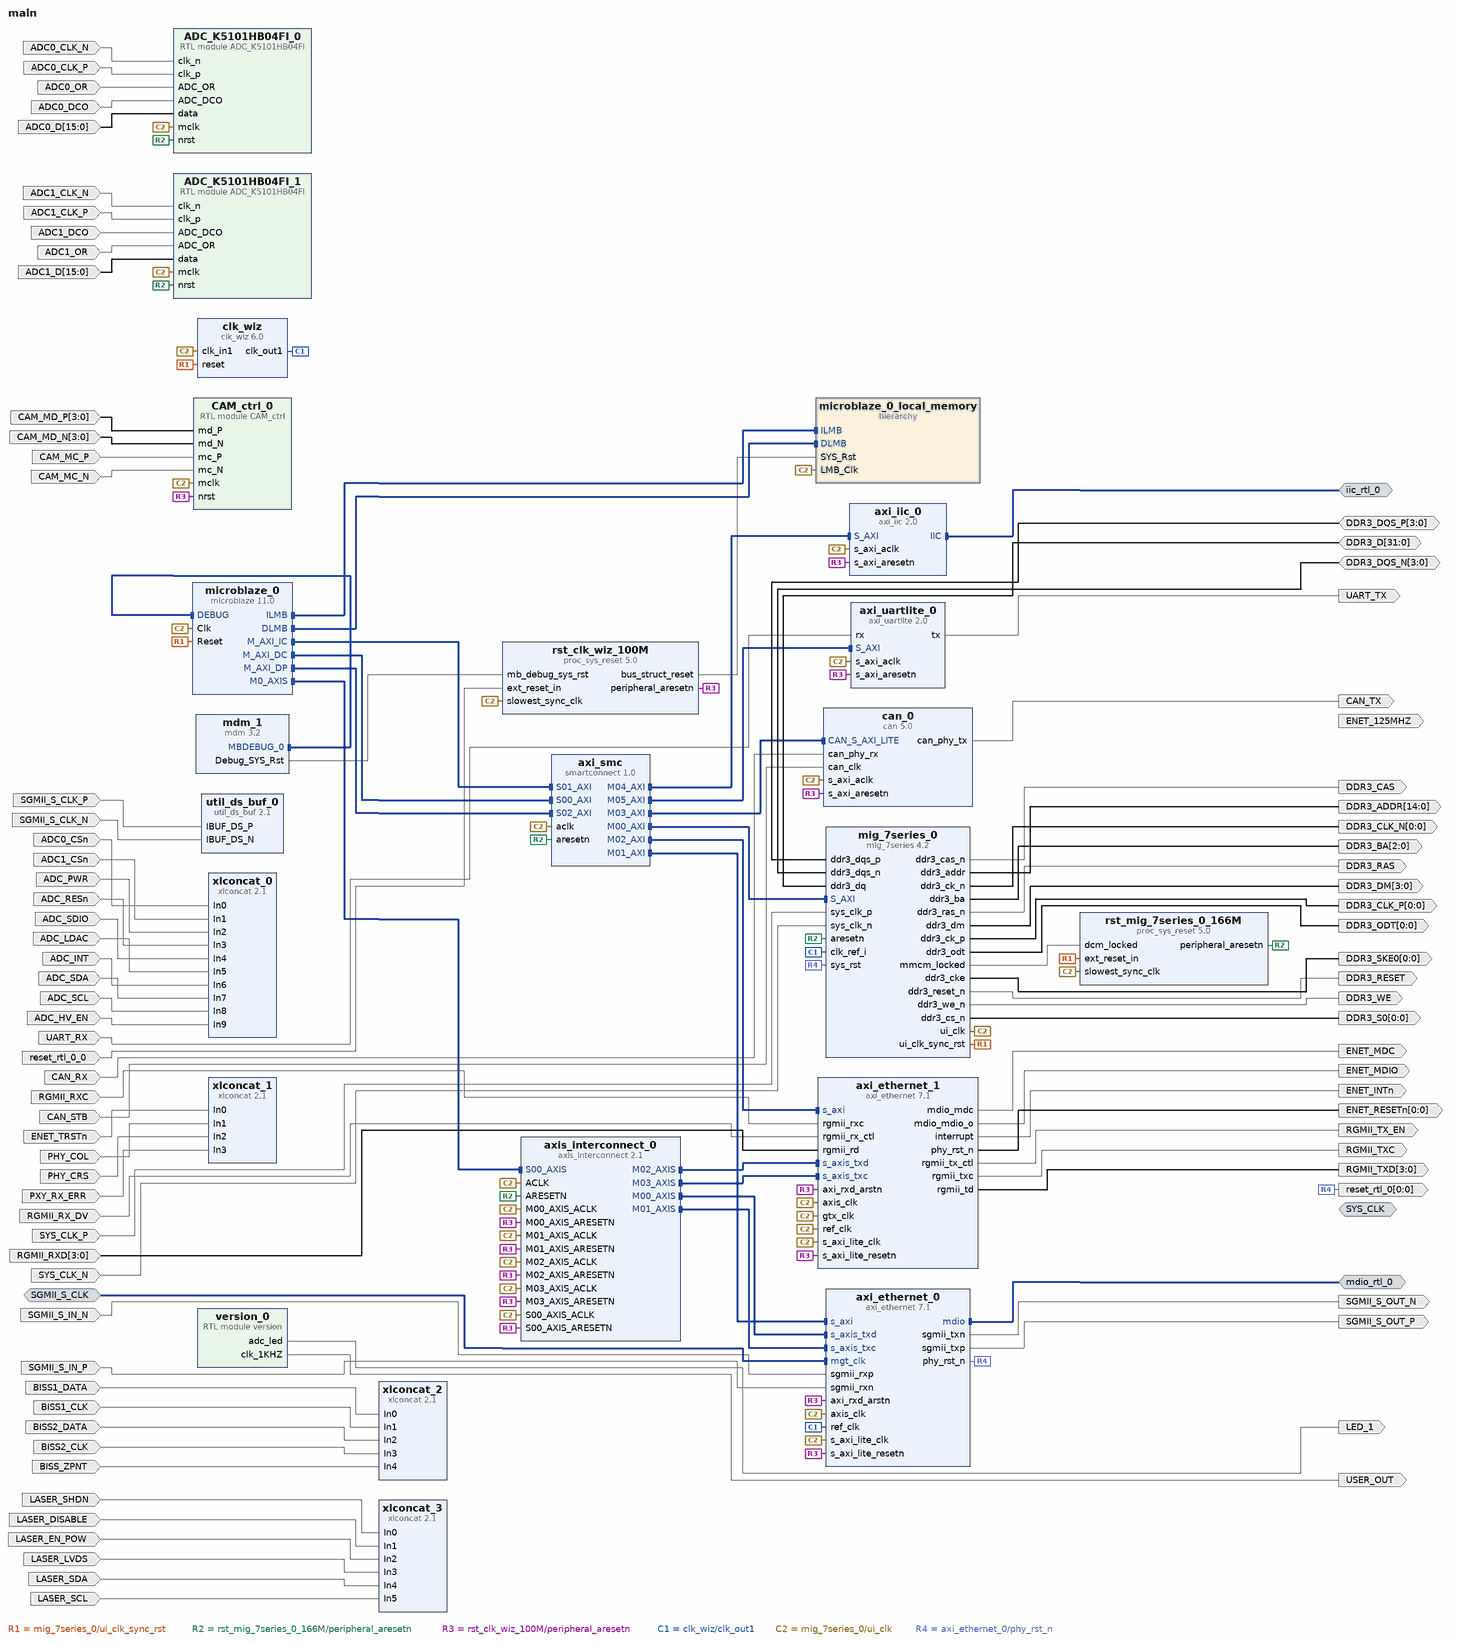
[diagram p0: block diagram of the top level]
# Vivado block design main, xc7a200tfbv484-2L, Vivado 2019.1
create_bd_design main

create_bd_intf_port -mode Master -vlnv xilinx.com:interface:mdio_rtl:1.0 mdio_rtl_0
create_bd_intf_port -mode Slave -vlnv xilinx.com:interface:diff_clock_rtl:1.0 SGMII_S_CLK
set_property -dict {CONFIG.FREQ_HZ 100000000} [get_bd_intf_ports SGMII_S_CLK]
create_bd_intf_port -mode Master -vlnv xilinx.com:interface:iic_rtl:1.0 iic_rtl_0
create_bd_intf_port -mode Master -vlnv xilinx.com:interface:diff_clock_rtl:1.0 SYS_CLK
create_bd_port -dir O -from 14 -to 0 DDR3_ADDR
create_bd_port -dir IO -from 31 -to 0 DDR3_D
create_bd_port -dir O DDR3_RAS
create_bd_port -dir O DDR3_CAS
create_bd_port -dir O DDR3_WE
create_bd_port -dir O -from 0 -to 0 DDR3_S0
create_bd_port -dir O -from 0 -to 0 DDR3_ODT
create_bd_port -dir O -from 0 -to 0 DDR3_SKE0
create_bd_port -dir O DDR3_RESET
create_bd_port -dir O -from 0 -to 0 DDR3_CLK_P
create_bd_port -dir O -from 0 -to 0 DDR3_CLK_N
create_bd_port -dir I SGMII_S_IN_P
create_bd_port -dir I SGMII_S_IN_N
create_bd_port -dir O SGMII_S_OUT_P
create_bd_port -dir O SGMII_S_OUT_N
create_bd_port -dir O ENET_MDC
create_bd_port -dir O -from 0 -to 0 ENET_RESETn
create_bd_port -dir O ENET_INTn
create_bd_port -dir O ENET_125MHZ
create_bd_port -dir O -from 3 -to 0 RGMII_TXD
create_bd_port -dir I -from 3 -to 0 RGMII_RXD
create_bd_port -dir O RGMII_TXC
create_bd_port -dir O RGMII_TX_EN
create_bd_port -dir I RGMII_RXC
create_bd_port -dir I RGMII_RX_DV
create_bd_port -dir O ENET_MDIO
create_bd_port -dir O -from 3 -to 0 DDR3_DM
create_bd_port -dir IO -from 3 -to 0 DDR3_DQS_N
create_bd_port -dir IO -from 3 -to 0 DDR3_DQS_P
create_bd_port -dir O -from 2 -to 0 DDR3_BA
create_bd_port -dir I -type rst reset_rtl_0_0
set_property -dict {CONFIG.POLARITY ACTIVE_LOW} [get_bd_ports reset_rtl_0_0]
create_bd_port -dir I -type rst CAN_RX
set_property -dict {CONFIG.POLARITY ACTIVE_LOW} [get_bd_ports CAN_RX]
create_bd_port -dir O CAN_TX
create_bd_port -dir I -type rst UART_RX
set_property -dict {CONFIG.POLARITY ACTIVE_LOW} [get_bd_ports UART_RX]
create_bd_port -dir O UART_TX
create_bd_port -dir O -from 0 -to 0 -type rst reset_rtl_0
set_property -dict {CONFIG.POLARITY ACTIVE_LOW} [get_bd_ports reset_rtl_0]
create_bd_port -dir I ADC0_CLK_P
create_bd_port -dir I ADC0_CLK_N
create_bd_port -dir I ADC0_DCO
create_bd_port -dir I ADC0_OR
create_bd_port -dir I -from 15 -to 0 ADC0_D
create_bd_port -dir I ADC1_CLK_N
create_bd_port -dir I ADC1_CLK_P
create_bd_port -dir I -from 15 -to 0 ADC1_D
create_bd_port -dir I ADC1_DCO
create_bd_port -dir I ADC1_OR
create_bd_port -dir I PHY_COL
create_bd_port -dir I PXY_RX_ERR
create_bd_port -dir I ENET_TRSTn
create_bd_port -dir I PHY_CRS
create_bd_port -dir I ADC0_CSn
create_bd_port -dir I ADC1_CSn
create_bd_port -dir I ADC_PWR
create_bd_port -dir I ADC_SDIO
create_bd_port -dir I ADC_RESn
create_bd_port -dir I ADC_SDA
create_bd_port -dir I ADC_LDAC
create_bd_port -dir I ADC_INT
create_bd_port -dir I ADC_SCL
create_bd_port -dir I ADC_HV_EN
create_bd_port -dir I BISS1_DATA
create_bd_port -dir I BISS1_CLK
create_bd_port -dir I BISS2_DATA
create_bd_port -dir I BISS2_CLK
create_bd_port -dir I BISS_ZPNT
create_bd_port -dir O LED_1
create_bd_port -dir O USER_OUT
create_bd_port -dir I LASER_SHDN
create_bd_port -dir I LASER_DISABLE
create_bd_port -dir I LASER_EN_POW
create_bd_port -dir I LASER_LVDS
create_bd_port -dir I LASER_SDA
create_bd_port -dir I LASER_SCL
create_bd_port -dir I -from 3 -to 0 CAM_MD_N
create_bd_port -dir I -from 3 -to 0 CAM_MD_P
create_bd_port -dir I CAM_MC_P
create_bd_port -dir I CAM_MC_N
create_bd_port -dir I -type clk CAN_STB
set_property -dict {CONFIG.FREQ_HZ 10000000} [get_bd_ports CAN_STB]
create_bd_port -dir I -type clk SYS_CLK_P
set_property -dict {CONFIG.FREQ_HZ 133000000} [get_bd_ports SYS_CLK_P]
create_bd_port -dir I -type clk SYS_CLK_N
set_property -dict {CONFIG.FREQ_HZ 133000000} [get_bd_ports SYS_CLK_N]
create_bd_port -dir I -type clk SGMII_S_CLK_P
set_property -dict {CONFIG.FREQ_HZ 200000000} [get_bd_ports SGMII_S_CLK_P]
create_bd_port -dir I -type clk SGMII_S_CLK_N
set_property -dict {CONFIG.FREQ_HZ 200000000} [get_bd_ports SGMII_S_CLK_N]

create_bd_cell -type ip -vlnv xilinx.com:ip:axi_ethernet:7.1 axi_ethernet_1
set_property -dict {CONFIG.PHY_TYPE RGMII} [get_bd_cells axi_ethernet_1]
create_bd_cell -type ip -vlnv xilinx.com:ip:util_ds_buf:2.1 util_ds_buf_0
set_property -dict {CONFIG.C_BUF_TYPE IBUFDS} [get_bd_cells util_ds_buf_0]
create_bd_cell -type ip -vlnv xilinx.com:ip:axi_ethernet:7.1 axi_ethernet_0
set_property -dict {CONFIG.PHY_TYPE SGMII} [get_bd_cells axi_ethernet_0]
create_bd_cell -type ip -vlnv xilinx.com:ip:mig_7series:4.2 mig_7series_0
set_property -dict [list \
  CONFIG.BOARD_MIG_PARAM Custom \
  CONFIG.MIG_DONT_TOUCH_PARAM Custom \
  CONFIG.RESET_BOARD_INTERFACE Custom \
  CONFIG.XML_INPUT_FILE mig_b.prj \
] [get_bd_cells mig_7series_0]
create_bd_cell -type ip -vlnv xilinx.com:ip:microblaze:11.0 microblaze_0
set_property -dict [list \
  CONFIG.C_CACHE_BYTE_SIZE 8192 \
  CONFIG.C_DCACHE_ADDR_TAG 17 \
  CONFIG.C_DCACHE_BYTE_SIZE 8192 \
  CONFIG.C_DEBUG_ENABLED 1 \
  CONFIG.C_D_AXI 1 \
  CONFIG.C_D_LMB 1 \
  CONFIG.C_FSL_LINKS 1 \
  CONFIG.C_I_AXI 0 \
  CONFIG.C_I_LMB 1 \
  CONFIG.C_USE_DCACHE 1 \
  CONFIG.C_USE_ICACHE 1 \
] [get_bd_cells microblaze_0]
create_bd_cell -type ip -vlnv xilinx.com:ip:smartconnect:1.0 axi_smc
set_property -dict {CONFIG.NUM_MI 6 CONFIG.NUM_SI 3} [get_bd_cells axi_smc]
create_bd_cell -type ip -vlnv xilinx.com:ip:proc_sys_reset:5.0 rst_mig_7series_0_166M
create_bd_cell -type ip -vlnv xilinx.com:ip:axis_interconnect:2.1 axis_interconnect_0
set_property -dict {CONFIG.NUM_MI 4} [get_bd_cells axis_interconnect_0]
create_bd_cell -type ip -vlnv xilinx.com:ip:proc_sys_reset:5.0 rst_clk_wiz_100M
create_bd_cell -type ip -vlnv xilinx.com:ip:clk_wiz:6.0 clk_wiz
set_property -dict [list \
  CONFIG.CLKOUT2_JITTER 792.544 \
  CONFIG.CLKOUT2_PHASE_ERROR 832.251 \
  CONFIG.CLKOUT2_REQUESTED_OUT_FREQ 10.000 \
  CONFIG.CLKOUT2_USED true \
  CONFIG.MMCM_CLKOUT1_DIVIDE 65 \
  CONFIG.NUM_OUT_CLKS 2 \
] [get_bd_cells clk_wiz]
create_bd_cell -type hier microblaze_0_local_memory
create_bd_cell -type ip -vlnv xilinx.com:ip:mdm:3.2 mdm_1
create_bd_cell -type ip -vlnv xilinx.com:ip:can:5.0 can_0
create_bd_cell -type ip -vlnv xilinx.com:ip:axi_iic:2.0 axi_iic_0
create_bd_cell -type ip -vlnv xilinx.com:ip:axi_uartlite:2.0 axi_uartlite_0
create_bd_cell -type ip -vlnv xilinx.com:ip:xlconcat:2.1 xlconcat_0
set_property -dict {CONFIG.NUM_PORTS 10} [get_bd_cells xlconcat_0]
create_bd_cell -type ip -vlnv xilinx.com:ip:xlconcat:2.1 xlconcat_1
set_property -dict {CONFIG.NUM_PORTS 4} [get_bd_cells xlconcat_1]
create_bd_cell -type ip -vlnv xilinx.com:ip:xlconcat:2.1 xlconcat_2
set_property -dict {CONFIG.NUM_PORTS 5} [get_bd_cells xlconcat_2]
create_bd_cell -type module -reference version version_0
create_bd_cell -type ip -vlnv xilinx.com:ip:xlconcat:2.1 xlconcat_3
set_property -dict {CONFIG.NUM_PORTS 6} [get_bd_cells xlconcat_3]
create_bd_cell -type module -reference ADC_K5101HB04FI ADC_K5101HB04FI_1
create_bd_cell -type module -reference ADC_K5101HB04FI ADC_K5101HB04FI_0
create_bd_cell -type module -reference CAM_ctrl CAM_ctrl_0

# ---- hierarchy /microblaze_0_local_memory ----
current_bd_instance /microblaze_0_local_memory
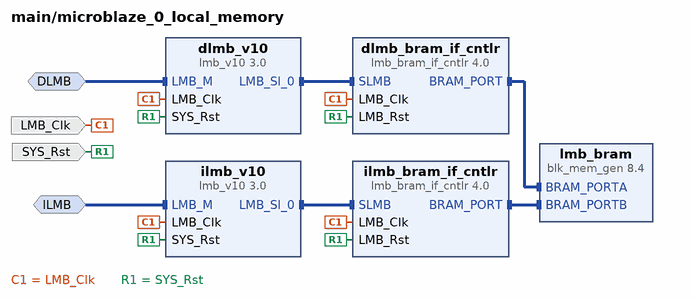
[diagram p1: block diagram inside /microblaze_0_local_memory]
create_bd_intf_pin -mode MirroredMaster -vlnv xilinx.com:interface:lmb_rtl:1.0 DLMB
create_bd_intf_pin -mode MirroredMaster -vlnv xilinx.com:interface:lmb_rtl:1.0 ILMB
create_bd_pin -dir I -type clk LMB_Clk
create_bd_pin -dir I -type rst SYS_Rst

create_bd_cell -type ip -vlnv xilinx.com:ip:lmb_v10:3.0 dlmb_v10
create_bd_cell -type ip -vlnv xilinx.com:ip:lmb_v10:3.0 ilmb_v10
create_bd_cell -type ip -vlnv xilinx.com:ip:lmb_bram_if_cntlr:4.0 dlmb_bram_if_cntlr
set_property -dict {CONFIG.C_ECC 0} [get_bd_cells dlmb_bram_if_cntlr]
create_bd_cell -type ip -vlnv xilinx.com:ip:lmb_bram_if_cntlr:4.0 ilmb_bram_if_cntlr
set_property -dict {CONFIG.C_ECC 0} [get_bd_cells ilmb_bram_if_cntlr]
create_bd_cell -type ip -vlnv xilinx.com:ip:blk_mem_gen:8.4 lmb_bram
set_property -dict {CONFIG.Memory_Type True_Dual_Port_RAM CONFIG.use_bram_block BRAM_Controller} [get_bd_cells lmb_bram]

# ---- connections ----

current_bd_instance /microblaze_0_local_memory
connect_bd_intf_net -intf_net microblaze_0_ilmb_cntlr [get_bd_intf_pins ilmb_bram_if_cntlr/BRAM_PORT] [get_bd_intf_pins lmb_bram/BRAM_PORTB]
connect_bd_intf_net -intf_net microblaze_0_dlmb_bus [get_bd_intf_pins dlmb_v10/LMB_Sl_0] [get_bd_intf_pins dlmb_bram_if_cntlr/SLMB]
connect_bd_intf_net -intf_net microblaze_0_ilmb_bus [get_bd_intf_pins ilmb_v10/LMB_Sl_0] [get_bd_intf_pins ilmb_bram_if_cntlr/SLMB]
connect_bd_intf_net -intf_net microblaze_0_ilmb [get_bd_intf_pins ILMB] [get_bd_intf_pins ilmb_v10/LMB_M]
connect_bd_intf_net -intf_net microblaze_0_dlmb [get_bd_intf_pins DLMB] [get_bd_intf_pins dlmb_v10/LMB_M]
connect_bd_intf_net -intf_net microblaze_0_dlmb_cntlr [get_bd_intf_pins dlmb_bram_if_cntlr/BRAM_PORT] [get_bd_intf_pins lmb_bram/BRAM_PORTA]
connect_bd_net -net mig_7series_0_ui_clk [get_bd_pins LMB_Clk] \
  [get_bd_pins dlmb_v10/LMB_Clk] [get_bd_pins dlmb_bram_if_cntlr/LMB_Clk] [get_bd_pins ilmb_v10/LMB_Clk] \
  [get_bd_pins ilmb_bram_if_cntlr/LMB_Clk]
connect_bd_net [get_bd_pins SYS_Rst] \
  [get_bd_pins dlmb_v10/SYS_Rst] [get_bd_pins dlmb_bram_if_cntlr/LMB_Rst] [get_bd_pins ilmb_v10/SYS_Rst] \
  [get_bd_pins ilmb_bram_if_cntlr/LMB_Rst]
set_property HDL_ATTRIBUTE.BMM_INFO_ADDRESS_SPACE {byte  0x00000000 32 > main microblaze_0_local_memory/lmb_bram} [get_bd_cells dlmb_bram_if_cntlr]
set_property HDL_ATTRIBUTE.KEEP_HIERARCHY yes [get_bd_cells dlmb_bram_if_cntlr]

current_bd_instance /
connect_bd_intf_net [get_bd_intf_pins axis_interconnect_0/M00_AXIS] [get_bd_intf_pins axi_ethernet_0/s_axis_txd]
connect_bd_intf_net [get_bd_intf_pins axi_smc/M01_AXI] [get_bd_intf_pins axi_ethernet_0/s_axi]
connect_bd_intf_net [get_bd_intf_pins microblaze_0/ILMB] [get_bd_intf_pins microblaze_0_local_memory/ILMB]
connect_bd_intf_net [get_bd_intf_pins axis_interconnect_0/M01_AXIS] [get_bd_intf_pins axi_ethernet_0/s_axis_txc]
connect_bd_intf_net [get_bd_intf_ports mdio_rtl_0] [get_bd_intf_pins axi_ethernet_0/mdio]
connect_bd_intf_net [get_bd_intf_pins axi_smc/M03_AXI] [get_bd_intf_pins can_0/CAN_S_AXI_LITE]
connect_bd_intf_net [get_bd_intf_pins axi_smc/M00_AXI] [get_bd_intf_pins mig_7series_0/S_AXI]
connect_bd_intf_net [get_bd_intf_pins microblaze_0/M_AXI_IC] [get_bd_intf_pins axi_smc/S01_AXI]
connect_bd_intf_net [get_bd_intf_pins axis_interconnect_0/M02_AXIS] [get_bd_intf_pins axi_ethernet_1/s_axis_txd]
connect_bd_intf_net [get_bd_intf_pins microblaze_0/M0_AXIS] [get_bd_intf_pins axis_interconnect_0/S00_AXIS]
connect_bd_intf_net -intf_net diff_clock_rtl_0_1 [get_bd_intf_ports SGMII_S_CLK] [get_bd_intf_pins axi_ethernet_0/mgt_clk]
connect_bd_intf_net [get_bd_intf_ports iic_rtl_0] [get_bd_intf_pins axi_iic_0/IIC]
connect_bd_intf_net [get_bd_intf_pins axi_smc/M02_AXI] [get_bd_intf_pins axi_ethernet_1/s_axi]
connect_bd_intf_net [get_bd_intf_pins microblaze_0/M_AXI_DC] [get_bd_intf_pins axi_smc/S00_AXI]
connect_bd_intf_net [get_bd_intf_pins axi_smc/M05_AXI] [get_bd_intf_pins axi_uartlite_0/S_AXI]
connect_bd_intf_net [get_bd_intf_pins mdm_1/MBDEBUG_0] [get_bd_intf_pins microblaze_0/DEBUG]
connect_bd_intf_net [get_bd_intf_pins microblaze_0/M_AXI_DP] [get_bd_intf_pins axi_smc/S02_AXI]
connect_bd_intf_net [get_bd_intf_pins microblaze_0/DLMB] [get_bd_intf_pins microblaze_0_local_memory/DLMB]
connect_bd_intf_net [get_bd_intf_pins axis_interconnect_0/M03_AXIS] [get_bd_intf_pins axi_ethernet_1/s_axis_txc]
connect_bd_intf_net [get_bd_intf_pins axi_smc/M04_AXI] [get_bd_intf_pins axi_iic_0/S_AXI]
connect_bd_net [get_bd_pins axi_ethernet_0/sgmii_txp] [get_bd_ports SGMII_S_OUT_P]
connect_bd_net [get_bd_pins axi_ethernet_0/sgmii_txn] [get_bd_ports SGMII_S_OUT_N]
connect_bd_net -net SGMII_S_IN_P1_1 [get_bd_ports SGMII_S_IN_N] [get_bd_pins axi_ethernet_0/sgmii_rxp]
connect_bd_net [get_bd_ports SGMII_S_IN_P] [get_bd_pins axi_ethernet_0/sgmii_rxn]
connect_bd_net [get_bd_pins axi_ethernet_1/rgmii_txc] [get_bd_ports RGMII_TXC]
connect_bd_net [get_bd_pins axi_ethernet_1/rgmii_tx_ctl] [get_bd_ports RGMII_TX_EN]
connect_bd_net [get_bd_pins axi_ethernet_1/rgmii_td] [get_bd_ports RGMII_TXD]
connect_bd_net [get_bd_ports RGMII_RXC] [get_bd_pins axi_ethernet_1/rgmii_rxc]
connect_bd_net [get_bd_ports RGMII_RX_DV] [get_bd_pins axi_ethernet_1/rgmii_rx_ctl]
connect_bd_net [get_bd_ports RGMII_RXD] [get_bd_pins axi_ethernet_1/rgmii_rd]
connect_bd_net [get_bd_pins axi_ethernet_1/mdio_mdio_o] [get_bd_ports ENET_MDIO]
connect_bd_net [get_bd_pins axi_ethernet_1/mdio_mdc] [get_bd_ports ENET_MDC]
connect_bd_net [get_bd_pins axi_ethernet_1/phy_rst_n] [get_bd_ports ENET_RESETn]
connect_bd_net [get_bd_pins axi_ethernet_1/interrupt] [get_bd_ports ENET_INTn]
connect_bd_net [get_bd_pins mig_7series_0/ddr3_ras_n] [get_bd_ports DDR3_RAS]
connect_bd_net [get_bd_pins mig_7series_0/ddr3_cas_n] [get_bd_ports DDR3_CAS]
connect_bd_net [get_bd_pins mig_7series_0/ddr3_cke] [get_bd_ports DDR3_SKE0]
connect_bd_net [get_bd_pins mig_7series_0/ddr3_odt] [get_bd_ports DDR3_ODT]
connect_bd_net [get_bd_pins mig_7series_0/ddr3_dm] [get_bd_ports DDR3_DM]
connect_bd_net [get_bd_pins mig_7series_0/ddr3_addr] [get_bd_ports DDR3_ADDR]
connect_bd_net [get_bd_ports DDR3_DQS_P] [get_bd_pins mig_7series_0/ddr3_dqs_p]
connect_bd_net [get_bd_ports DDR3_DQS_N] [get_bd_pins mig_7series_0/ddr3_dqs_n]
connect_bd_net [get_bd_pins mig_7series_0/ddr3_ck_n] [get_bd_ports DDR3_CLK_N]
connect_bd_net [get_bd_pins mig_7series_0/ddr3_reset_n] [get_bd_ports DDR3_RESET]
connect_bd_net [get_bd_pins mig_7series_0/ddr3_we_n] [get_bd_ports DDR3_WE]
connect_bd_net [get_bd_pins mig_7series_0/ddr3_ck_p] [get_bd_ports DDR3_CLK_P]
connect_bd_net [get_bd_ports DDR3_D] [get_bd_pins mig_7series_0/ddr3_dq]
connect_bd_net [get_bd_pins mig_7series_0/ddr3_ba] [get_bd_ports DDR3_BA]
connect_bd_net [get_bd_pins mig_7series_0/ddr3_cs_n] [get_bd_ports DDR3_S0]
connect_bd_net [get_bd_pins mig_7series_0/mmcm_locked] [get_bd_pins rst_mig_7series_0_166M/dcm_locked]
connect_bd_net [get_bd_pins mig_7series_0/ui_clk_sync_rst] \
  [get_bd_pins rst_mig_7series_0_166M/ext_reset_in] [get_bd_pins microblaze_0/Reset] [get_bd_pins clk_wiz/reset]
connect_bd_net [get_bd_pins rst_mig_7series_0_166M/peripheral_aresetn] \
  [get_bd_pins mig_7series_0/aresetn] [get_bd_pins axi_smc/aresetn] [get_bd_pins axis_interconnect_0/ARESETN] \
  [get_bd_pins ADC_K5101HB04FI_0/nrst] [get_bd_pins ADC_K5101HB04FI_1/nrst]
connect_bd_net [get_bd_pins rst_clk_wiz_100M/peripheral_aresetn] \
  [get_bd_pins axi_ethernet_1/s_axi_lite_resetn] [get_bd_pins axi_ethernet_0/s_axi_lite_resetn] \
  [get_bd_pins axis_interconnect_0/S00_AXIS_ARESETN] [get_bd_pins axis_interconnect_0/M00_AXIS_ARESETN] \
  [get_bd_pins axi_ethernet_0/axi_rxd_arstn] [get_bd_pins axis_interconnect_0/M01_AXIS_ARESETN] \
  [get_bd_pins axis_interconnect_0/M02_AXIS_ARESETN] [get_bd_pins axi_ethernet_1/axi_rxd_arstn] \
  [get_bd_pins axis_interconnect_0/M03_AXIS_ARESETN] [get_bd_pins can_0/s_axi_aresetn] [get_bd_pins axi_iic_0/s_axi_aresetn] \
  [get_bd_pins axi_uartlite_0/s_axi_aresetn] [get_bd_pins CAM_ctrl_0/nrst]
connect_bd_net [get_bd_pins clk_wiz/clk_out1] [get_bd_pins axi_ethernet_0/ref_clk] [get_bd_pins mig_7series_0/clk_ref_i]
connect_bd_net -net reset_rtl_0_0_1 [get_bd_ports reset_rtl_0_0] [get_bd_pins rst_clk_wiz_100M/ext_reset_in]
connect_bd_net [get_bd_pins mig_7series_0/ui_clk] \
  [get_bd_pins axi_ethernet_1/ref_clk] [get_bd_pins axi_smc/aclk] [get_bd_pins rst_mig_7series_0_166M/slowest_sync_clk] \
  [get_bd_pins microblaze_0/Clk] [get_bd_pins axis_interconnect_0/ACLK] [get_bd_pins axi_ethernet_1/gtx_clk] \
  [get_bd_pins axi_ethernet_1/s_axi_lite_clk] [get_bd_pins rst_clk_wiz_100M/slowest_sync_clk] \
  [get_bd_pins axi_ethernet_0/s_axi_lite_clk] [get_bd_pins axis_interconnect_0/S00_AXIS_ACLK] \
  [get_bd_pins axis_interconnect_0/M00_AXIS_ACLK] [get_bd_pins axi_ethernet_0/axis_clk] \
  [get_bd_pins axis_interconnect_0/M01_AXIS_ACLK] [get_bd_pins axis_interconnect_0/M02_AXIS_ACLK] \
  [get_bd_pins axi_ethernet_1/axis_clk] [get_bd_pins axis_interconnect_0/M03_AXIS_ACLK] [get_bd_pins clk_wiz/clk_in1] \
  [get_bd_pins microblaze_0_local_memory/LMB_Clk] [get_bd_pins can_0/s_axi_aclk] [get_bd_pins axi_iic_0/s_axi_aclk] \
  [get_bd_pins axi_uartlite_0/s_axi_aclk] [get_bd_pins CAM_ctrl_0/mclk] [get_bd_pins ADC_K5101HB04FI_1/mclk] \
  [get_bd_pins ADC_K5101HB04FI_0/mclk]
connect_bd_net [get_bd_pins rst_clk_wiz_100M/bus_struct_reset] [get_bd_pins microblaze_0_local_memory/SYS_Rst]
connect_bd_net [get_bd_pins mdm_1/Debug_SYS_Rst] [get_bd_pins rst_clk_wiz_100M/mb_debug_sys_rst]
connect_bd_net -net reset_rtl_0_1_1 [get_bd_ports CAN_RX] [get_bd_pins can_0/can_phy_rx]
connect_bd_net [get_bd_pins can_0/can_phy_tx] [get_bd_ports CAN_TX]
connect_bd_net -net UART_TX_1 [get_bd_ports UART_RX] [get_bd_pins axi_uartlite_0/rx]
connect_bd_net [get_bd_pins axi_uartlite_0/tx] [get_bd_ports UART_TX]
connect_bd_net [get_bd_pins axi_ethernet_0/phy_rst_n] [get_bd_ports reset_rtl_0] [get_bd_pins mig_7series_0/sys_rst]
connect_bd_net [get_bd_ports ADC0_CLK_N] [get_bd_pins ADC_K5101HB04FI_0/clk_n]
connect_bd_net [get_bd_ports ADC0_CLK_P] [get_bd_pins ADC_K5101HB04FI_0/clk_p]
connect_bd_net -net ADC0_CLK_N4_1 [get_bd_ports ADC0_OR] [get_bd_pins ADC_K5101HB04FI_0/ADC_OR]
connect_bd_net -net ADC0_CLK_N2_1 [get_bd_ports ADC0_DCO] [get_bd_pins ADC_K5101HB04FI_0/ADC_DCO]
connect_bd_net -net ADC0_DATA_1 [get_bd_ports ADC0_D] [get_bd_pins ADC_K5101HB04FI_0/data]
connect_bd_net -net ADC0_CLK_N1_1 [get_bd_ports ADC1_CLK_N] [get_bd_pins ADC_K5101HB04FI_1/clk_n]
connect_bd_net -net ADC0_CLK_P1_1 [get_bd_ports ADC1_CLK_P] [get_bd_pins ADC_K5101HB04FI_1/clk_p]
connect_bd_net -net ADC0_DCO1_1 [get_bd_ports ADC1_DCO] [get_bd_pins ADC_K5101HB04FI_1/ADC_DCO]
connect_bd_net -net ADC0_OR1_1 [get_bd_ports ADC1_OR] [get_bd_pins ADC_K5101HB04FI_1/ADC_OR]
connect_bd_net -net ADC0_D1_1 [get_bd_ports ADC1_D] [get_bd_pins ADC_K5101HB04FI_1/data]
connect_bd_net [get_bd_ports ADC0_CSn] [get_bd_pins xlconcat_0/In0]
connect_bd_net [get_bd_ports ADC1_CSn] [get_bd_pins xlconcat_0/In1]
connect_bd_net [get_bd_ports ADC_PWR] [get_bd_pins xlconcat_0/In2]
connect_bd_net [get_bd_ports ADC_RESn] [get_bd_pins xlconcat_0/In3]
connect_bd_net [get_bd_ports ADC_SDIO] [get_bd_pins xlconcat_0/In4]
connect_bd_net [get_bd_ports ADC_LDAC] [get_bd_pins xlconcat_0/In5]
connect_bd_net [get_bd_ports ADC_INT] [get_bd_pins xlconcat_0/In6]
connect_bd_net [get_bd_ports ADC_SDA] [get_bd_pins xlconcat_0/In7]
connect_bd_net [get_bd_ports ADC_SCL] [get_bd_pins xlconcat_0/In8]
connect_bd_net -net ADC_INT1_1 [get_bd_ports ADC_HV_EN] [get_bd_pins xlconcat_0/In9]
connect_bd_net [get_bd_ports ENET_TRSTn] [get_bd_pins xlconcat_1/In0]
connect_bd_net [get_bd_ports PHY_COL] [get_bd_pins xlconcat_1/In1]
connect_bd_net [get_bd_ports PHY_CRS] [get_bd_pins xlconcat_1/In2]
connect_bd_net [get_bd_ports PXY_RX_ERR] [get_bd_pins xlconcat_1/In3]
connect_bd_net [get_bd_ports BISS1_DATA] [get_bd_pins xlconcat_2/In0]
connect_bd_net [get_bd_ports BISS1_CLK] [get_bd_pins xlconcat_2/In1]
connect_bd_net [get_bd_ports BISS2_DATA] [get_bd_pins xlconcat_2/In2]
connect_bd_net [get_bd_ports BISS2_CLK] [get_bd_pins xlconcat_2/In3]
connect_bd_net [get_bd_ports BISS_ZPNT] [get_bd_pins xlconcat_2/In4]
connect_bd_net [get_bd_pins version_0/adc_led] [get_bd_ports LED_1]
connect_bd_net [get_bd_pins version_0/clk_1KHZ] [get_bd_ports USER_OUT]
connect_bd_net [get_bd_ports LASER_SHDN] [get_bd_pins xlconcat_3/In0]
connect_bd_net [get_bd_ports LASER_DISABLE] [get_bd_pins xlconcat_3/In1]
connect_bd_net [get_bd_ports LASER_EN_POW] [get_bd_pins xlconcat_3/In2]
connect_bd_net [get_bd_ports LASER_LVDS] [get_bd_pins xlconcat_3/In3]
connect_bd_net [get_bd_ports LASER_SDA] [get_bd_pins xlconcat_3/In4]
connect_bd_net [get_bd_ports LASER_SCL] [get_bd_pins xlconcat_3/In5]
connect_bd_net [get_bd_ports CAM_MD_P] [get_bd_pins CAM_ctrl_0/md_P]
connect_bd_net [get_bd_ports CAM_MD_N] [get_bd_pins CAM_ctrl_0/md_N]
connect_bd_net [get_bd_ports CAM_MC_P] [get_bd_pins CAM_ctrl_0/mc_P]
connect_bd_net [get_bd_ports CAM_MC_N] [get_bd_pins CAM_ctrl_0/mc_N]
connect_bd_net -net CAN_STB1_1 [get_bd_ports CAN_STB] [get_bd_pins can_0/can_clk]
connect_bd_net [get_bd_ports SYS_CLK_P] [get_bd_pins mig_7series_0/sys_clk_p]
connect_bd_net [get_bd_ports SYS_CLK_N] [get_bd_pins mig_7series_0/sys_clk_n]
connect_bd_net [get_bd_ports SGMII_S_CLK_P] [get_bd_pins util_ds_buf_0/IBUF_DS_P]
connect_bd_net [get_bd_ports SGMII_S_CLK_N] [get_bd_pins util_ds_buf_0/IBUF_DS_N]
set_property HDL_ATTRIBUTE.BMM_INFO_PROCESSOR {microblaze-le > main microblaze_0_local_memory/dlmb_bram_if_cntlr} [get_bd_cells microblaze_0]
set_property HDL_ATTRIBUTE.KEEP_HIERARCHY yes [get_bd_cells microblaze_0]

# ---- address map ----
assign_bd_address -offset 0x00000000 -range 8K -target_address_space [get_bd_addr_spaces microblaze_0/Data] [get_bd_addr_segs microblaze_0_local_memory/dlmb_bram_if_cntlr/SLMB/Mem]
assign_bd_address -offset 0x40600000 -range 64K -target_address_space [get_bd_addr_spaces microblaze_0/Data] [get_bd_addr_segs axi_uartlite_0/S_AXI/Reg]
assign_bd_address -offset 0x40800000 -range 64K -target_address_space [get_bd_addr_spaces microblaze_0/Data] [get_bd_addr_segs axi_iic_0/S_AXI/Reg]
assign_bd_address -offset 0x40C00000 -range 64K -target_address_space [get_bd_addr_spaces microblaze_0/Data] [get_bd_addr_segs axi_ethernet_0/s_axi/Reg0]
assign_bd_address -offset 0x40C10000 -range 64K -target_address_space [get_bd_addr_spaces microblaze_0/Data] [get_bd_addr_segs axi_ethernet_1/s_axi/Reg0]
assign_bd_address -offset 0x44A00000 -range 64K -target_address_space [get_bd_addr_spaces microblaze_0/Data] [get_bd_addr_segs can_0/CAN_S_AXI_LITE/Reg]
assign_bd_address -offset 0x80000000 -range 1G -target_address_space [get_bd_addr_spaces microblaze_0/Data] [get_bd_addr_segs mig_7series_0/memmap/memaddr]
assign_bd_address -offset 0x00000000 -range 8K -target_address_space [get_bd_addr_spaces microblaze_0/Instruction] [get_bd_addr_segs microblaze_0_local_memory/ilmb_bram_if_cntlr/SLMB/Mem]
assign_bd_address -offset 0x40600000 -range 64K -target_address_space [get_bd_addr_spaces microblaze_0/Instruction] [get_bd_addr_segs axi_uartlite_0/S_AXI/Reg]
assign_bd_address -offset 0x40800000 -range 64K -target_address_space [get_bd_addr_spaces microblaze_0/Instruction] [get_bd_addr_segs axi_iic_0/S_AXI/Reg]
assign_bd_address -offset 0x40C00000 -range 64K -target_address_space [get_bd_addr_spaces microblaze_0/Instruction] [get_bd_addr_segs axi_ethernet_0/s_axi/Reg0]
assign_bd_address -offset 0x40C10000 -range 64K -target_address_space [get_bd_addr_spaces microblaze_0/Instruction] [get_bd_addr_segs axi_ethernet_1/s_axi/Reg0]
assign_bd_address -offset 0x44A10000 -range 64K -target_address_space [get_bd_addr_spaces microblaze_0/Instruction] [get_bd_addr_segs can_0/CAN_S_AXI_LITE/Reg]
assign_bd_address -offset 0x80000000 -range 1G -target_address_space [get_bd_addr_spaces microblaze_0/Instruction] [get_bd_addr_segs mig_7series_0/memmap/memaddr]

validate_bd_design
save_bd_design
